# Altium schematic sheet TOP.SchDoc
size A4
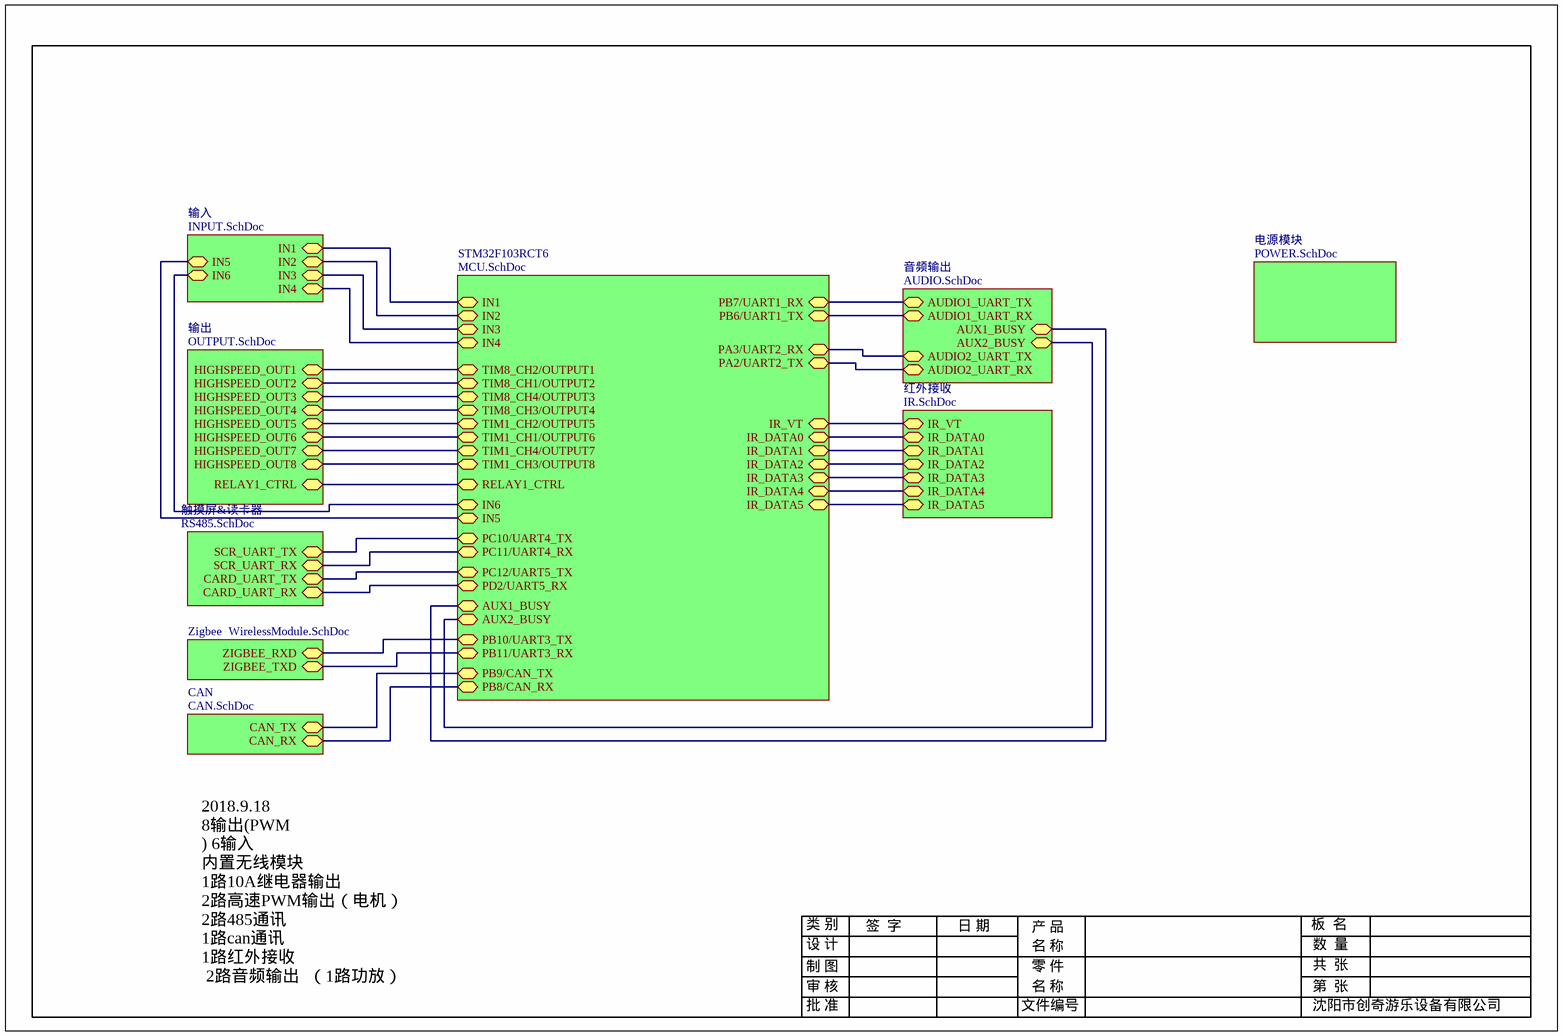
[diagram p0: TOP.SchDoc]

## Sub-sheets
CAN = CAN.SchDoc: CAN_RX, CAN_TX
STM32F103RCT6 = MCU.SchDoc: TIM8_CH2/OUTPUT1, TIM8_CH1/OUTPUT2, TIM8_CH4/OUTPUT3, TIM8_CH3/OUTPUT4, TIM1_CH2/OUTPUT5, TIM1_CH1/OUTPUT6, TIM1_CH4/OUTPUT7, TIM1_CH3/OUTPUT8, IR_DATA2 (bidir), IR_DATA3 (bidir), IR_DATA5 (bidir), IR_DATA4 (bidir), IR_DATA1 (bidir), IR_DATA0 (bidir), IR_VT (bidir), RELAY1_CTRL (bidir), IN6, IN5, PB8/CAN_RX, PB9/CAN_TX, PC12/UART5_TX, PD2/UART5_RX, AUX1_BUSY, AUX2_BUSY, PC10/UART4_TX, PC11/UART4_RX, IN4, IN3, IN1, IN2, PA3/UART2_RX, PA2/UART2_TX, PB6/UART1_TX, PB7/UART1_RX, PB10/UART3_TX, PB11/UART3_RX
Zigbee = WirelessModule.SchDoc: ZIGBEE_RXD, ZIGBEE_TXD
电源模块 = POWER.SchDoc: no entries
红外接收 = IR.SchDoc: IR_DATA5 (bidir), IR_VT (bidir), IR_DATA0 (bidir), IR_DATA2 (bidir), IR_DATA3 (bidir), IR_DATA4 (bidir), IR_DATA1 (bidir)
触摸屏&读卡器 = RS485.SchDoc: CARD_UART_RX (bidir), CARD_UART_TX (bidir), SCR_UART_TX (bidir), SCR_UART_RX (bidir)
输入 = INPUT.SchDoc: IN2, IN4, IN3, IN1, IN5, IN6
输出 = OUTPUT.SchDoc: HIGHSPEED_OUT1 (bidir), HIGHSPEED_OUT2 (bidir), HIGHSPEED_OUT3 (bidir), HIGHSPEED_OUT4 (bidir), HIGHSPEED_OUT6 (bidir), HIGHSPEED_OUT5 (bidir), HIGHSPEED_OUT7 (bidir), HIGHSPEED_OUT8 (bidir), RELAY1_CTRL (bidir)
音频输出 = AUDIO.SchDoc: AUX1_BUSY, AUX2_BUSY, AUDIO1_UART_TX (bidir), AUDIO1_UART_RX (bidir), AUDIO2_UART_RX (bidir), AUDIO2_UART_TX (bidir)

## Nets
(unnamed): sheet 音频输出/AUX1_BUSY, sheet STM32F103RCT6/AUX1_BUSY
(unnamed): sheet 音频输出/AUX2_BUSY, sheet STM32F103RCT6/AUX2_BUSY
(unnamed): sheet 音频输出/AUDIO1_UART_TX, sheet STM32F103RCT6/PB7/UART1_RX
(unnamed): sheet 音频输出/AUDIO1_UART_RX, sheet STM32F103RCT6/PB6/UART1_TX
(unnamed): sheet 音频输出/AUDIO2_UART_RX, sheet STM32F103RCT6/PA2/UART2_TX
(unnamed): sheet 音频输出/AUDIO2_UART_TX, sheet STM32F103RCT6/PA3/UART2_RX
(unnamed): sheet 输入/IN2, sheet STM32F103RCT6/IN2
(unnamed): sheet 输入/IN4, sheet STM32F103RCT6/IN4
(unnamed): sheet 输入/IN3, sheet STM32F103RCT6/IN3
(unnamed): sheet 输入/IN1, sheet STM32F103RCT6/IN1
(unnamed): sheet 输入/IN5, sheet STM32F103RCT6/IN5
(unnamed): sheet 输入/IN6, sheet STM32F103RCT6/IN6
(unnamed): sheet 红外接收/IR_DATA5, sheet STM32F103RCT6/IR_DATA5
(unnamed): sheet 红外接收/IR_VT, sheet STM32F103RCT6/IR_VT
(unnamed): sheet 红外接收/IR_DATA0, sheet STM32F103RCT6/IR_DATA0
(unnamed): sheet 红外接收/IR_DATA2, sheet STM32F103RCT6/IR_DATA2
(unnamed): sheet 红外接收/IR_DATA3, sheet STM32F103RCT6/IR_DATA3
(unnamed): sheet 红外接收/IR_DATA4, sheet STM32F103RCT6/IR_DATA4
(unnamed): sheet 红外接收/IR_DATA1, sheet STM32F103RCT6/IR_DATA1
(unnamed): sheet 输出/HIGHSPEED_OUT1, sheet STM32F103RCT6/TIM8_CH2/OUTPUT1
(unnamed): sheet 输出/HIGHSPEED_OUT2, sheet STM32F103RCT6/TIM8_CH1/OUTPUT2
(unnamed): sheet 输出/HIGHSPEED_OUT3, sheet STM32F103RCT6/TIM8_CH4/OUTPUT3
(unnamed): sheet 输出/HIGHSPEED_OUT4, sheet STM32F103RCT6/TIM8_CH3/OUTPUT4
(unnamed): sheet 输出/HIGHSPEED_OUT6, sheet STM32F103RCT6/TIM1_CH1/OUTPUT6
(unnamed): sheet 输出/HIGHSPEED_OUT5, sheet STM32F103RCT6/TIM1_CH2/OUTPUT5
(unnamed): sheet 输出/HIGHSPEED_OUT7, sheet STM32F103RCT6/TIM1_CH4/OUTPUT7
(unnamed): sheet 输出/HIGHSPEED_OUT8, sheet STM32F103RCT6/TIM1_CH3/OUTPUT8
(unnamed): sheet 输出/RELAY1_CTRL, sheet STM32F103RCT6/RELAY1_CTRL
(unnamed): sheet STM32F103RCT6/PB8/CAN_RX, sheet CAN/CAN_RX
(unnamed): sheet STM32F103RCT6/PB9/CAN_TX, sheet CAN/CAN_TX
(unnamed): sheet STM32F103RCT6/PC12/UART5_TX, sheet 触摸屏&读卡器/CARD_UART_TX
(unnamed): sheet STM32F103RCT6/PD2/UART5_RX, sheet 触摸屏&读卡器/CARD_UART_RX
(unnamed): sheet STM32F103RCT6/PC10/UART4_TX, sheet 触摸屏&读卡器/SCR_UART_TX
(unnamed): sheet STM32F103RCT6/PC11/UART4_RX, sheet 触摸屏&读卡器/SCR_UART_RX
(unnamed): sheet STM32F103RCT6/PB10/UART3_TX, sheet Zigbee/ZIGBEE_RXD
(unnamed): sheet STM32F103RCT6/PB11/UART3_RX, sheet Zigbee/ZIGBEE_TXD

## Notes on the sheet
- 2018.9.18
  8输出(PWM
  ) 6输入
  内置无线模块
  1路10A继电器输出
  2路高速PWM输出（电机）
  2路485通讯
  1路can通讯
  1路红外接收
  2路音频输出  （1路功放）
- 设 计
- 制 图
- 审 核
- 类 别
- 签  字
- 日 期
- 产 品
- 名 称
- 零 件
- 板  名
- 数  量
- 共  张
- 第  张
- 批 准
- 文件编号
- 沈阳市创奇游乐设备有限公司